# EAGLE design PCB-TLY-BRD4 (EAGLE 7.5.0)
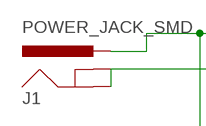
[diagram p0: schematic, sheet 1, part 1 of 2]
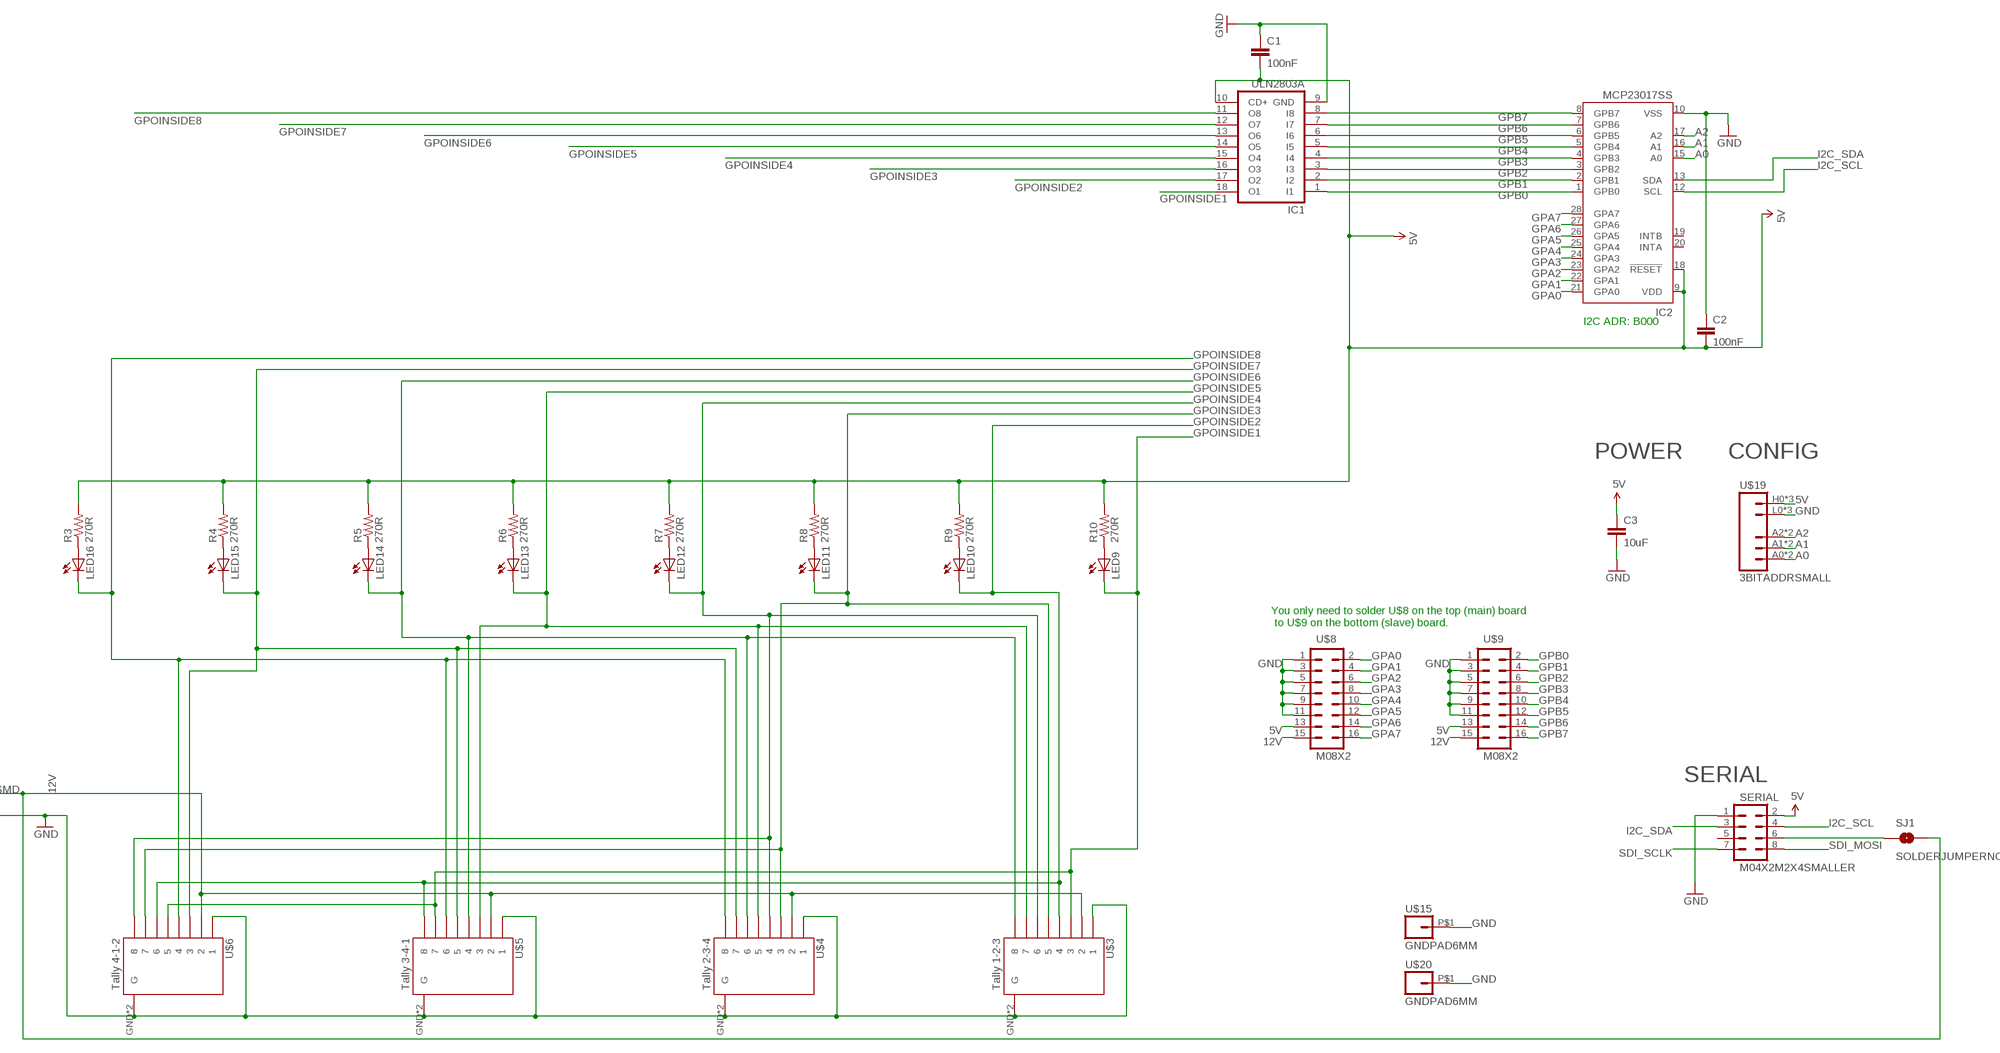
[diagram p1: schematic, sheet 1, part 2 of 2]

## Parts
C1  100nF  CAP0805  [0805]
C2  100nF  CAP0603-CAP  [0603-CAP]
C3  10uF  CAP0805  [0805]
IC1  ULN2803A  ULN2803ASO18W  [SO18W]
IC2  MCP23017SS  [SSOP28]
J1  POWER_JACK_SMD  [POWER_JACK_SMD]
LED9  LED3MM  [LED3MM]
LED10  LED3MM  [LED3MM]
LED11  LED3MM  [LED3MM]
LED12  LED3MM  [LED3MM]
LED13  LED3MM  [LED3MM]
LED14  LED3MM  [LED3MM]
LED15  LED3MM  [LED3MM]
LED16  LED3MM  [LED3MM]
R3  270R  RESISTOR0603-RES  [0603-RES]
R4  270R  RESISTOR0603-RES  [0603-RES]
R5  270R  RESISTOR0603-RES  [0603-RES]
R6  270R  RESISTOR0603-RES  [0603-RES]
R7  270R  RESISTOR0603-RES  [0603-RES]
R8  270R  RESISTOR0603-RES  [0603-RES]
R9  270R  RESISTOR0603-RES  [0603-RES]
R10  270R  RESISTOR0603-RES  [0603-RES]
SERIAL  M04X2M2X4SMALLER  [M2X4SMALLER]
SJ1  SOLDERJUMPERNC2  [SJ_2S-NOTRACE]
U$3  Tally 1-2-3  RJ45-8_GND  [RJ45-8_GND]
U$4  Tally 2-3-4  RJ45-8_GND  [RJ45-8_GND]
U$5  Tally 3-4-1  RJ45-8_GND  [RJ45-8_GND]
U$6  Tally 4-1-2  RJ45-8_GND  [RJ45-8_GND]
U$8  M08X2  [2X8]
U$9  M08X2  [2X8]
U$15  GNDPAD6MM  [3.2MMPAD6MM]
U$19  3BITADDRSMALL  [3BITADDR_SMALL]
U$20  GNDPAD6MM  [3.2MMPAD6MM]

## Nets
5V [Power]: C1.2 C2.2 C3.1 IC1.10(CD+) IC2.9(VDD) IC2.18(!RESET) R3.2 R4.2 R5.2 R6.2 R7.2 R8.2 R9.2 R10.2 SERIAL.2 U$8.13 U$9.13 U$19.H0(VCC) U$19.H1(VCC) U$19.H2(VCC)
12V [Power]: J1.PWR SJ1.2 U$3.2 U$4.2 U$5.2 U$6.2 U$8.15 U$9.15
A0: IC2.15(A0) U$19.A0 U$19.AS0(A0)
A1: IC2.16(A1) U$19.A1 U$19.AS1(A1)
A2: IC2.17(A2) U$19.A2 U$19.AS2(A2)
GND [Power]: C1.1 C2.1 C3.2 IC1.9(GND) IC2.10(VSS) J1.GND SERIAL.1 U$3.1 U$3.GND1(G) U$3.GND(G) U$4.1 U$4.GND1(G) U$4.GND(G) U$5.1 U$5.GND1(G) U$5.GND(G) U$6.1 U$6.GND1(G) U$6.GND(G) U$8.1 U$8.3 U$8.5 U$8.7 U$8.9 U$8.11 U$9.1 U$9.3 U$9.5 U$9.7 U$9.9 U$9.11 U$15.P$1 U$19.L0(GND) U$19.L1(GND) U$19.L2(GND) U$20.P$1
GPA0: IC2.21(GPA0) U$8.2
GPA1: IC2.22(GPA1) U$8.4
GPA2: IC2.23(GPA2) U$8.6
GPA3: IC2.24(GPA3) U$8.8
GPA4: IC2.25(GPA4) U$8.10
GPA5: IC2.26(GPA5) U$8.12
GPA6: IC2.27(GPA6) U$8.14
GPA7: IC2.28(GPA7) U$8.16
GPB0: IC1.1(I1) IC2.1(GPB0) U$9.2
GPB1: IC1.2(I2) IC2.2(GPB1) U$9.4
GPB2: IC1.3(I3) IC2.3(GPB2) U$9.6
GPB3: IC1.4(I4) IC2.4(GPB3) U$9.8
GPB4: IC1.5(I5) IC2.5(GPB4) U$9.10
GPB5: IC1.6(I6) IC2.6(GPB5) U$9.12
GPB6: IC1.7(I7) IC2.7(GPB6) U$9.14
GPB7: IC1.8(I8) IC2.8(GPB7) U$9.16
GPOINSIDE1: IC1.18(O1) LED9.K(C) U$3.3 U$5.7 U$6.5
GPOINSIDE2: IC1.17(O2) LED10.K(C) U$3.4 U$5.8 U$6.6
GPOINSIDE3: IC1.16(O3) LED11.K(C) U$3.5 U$4.3 U$6.7
GPOINSIDE4: IC1.15(O4) LED12.K(C) U$3.6 U$4.4 U$6.8
GPOINSIDE5: IC1.14(O5) LED13.K(C) U$3.7 U$4.5 U$5.3
GPOINSIDE6: IC1.13(O6) LED14.K(C) U$3.8 U$4.6 U$5.4
GPOINSIDE7: IC1.12(O7) LED15.K(C) U$4.7 U$5.5 U$6.3
GPOINSIDE8: IC1.11(O8) LED16.K(C) U$4.8 U$5.6 U$6.4
I2C_SCL: IC2.12(SCL) SERIAL.4
I2C_SDA: IC2.13(SDA) SERIAL.3
N$1 [Power]: SERIAL.6 SJ1.1
N$2: LED16.A R3.1
N$3: LED15.A R4.1
N$4: LED14.A R5.1
N$7: LED13.A R6.1
N$8: LED12.A R7.1
N$9: LED11.A R8.1
N$11: LED10.A R9.1
N$12: LED9.A R10.1
SDI_MOSI: SERIAL.8
SDI_SCLK: SERIAL.7
Unconnected: IC2.19(INTB) IC2.20(INTA) J1.SHUNT(GNDBREAK) SERIAL.5

## Notes on the sheet
- I2C ADR: B000
- POWER | CONFIG
- You only need to solder U$8 on the top (main) board
   to U$9 on the bottom (slave) board.
- SERIAL

## Library data of the parts
C1-C3 = SparkFun:CAP: Capacitor Standard 0603 ceramic capacitor, and 0.1" leaded capacitor.
IC1 = uln-udn:ULN2803A: DRIVER ARRAY
IC2 = microchip:MCP23017: http://ww1.microchip.com/downloads/en/DeviceDoc/21952a.pdf Source: http://ww1.microchip.com/downloads/en/DeviceDoc/21952a.pdf; MF: MICROCHIP; MPN: MCP23017-E/SS; OC_FARNELL: 1467674; OC_NEWARK: 31K2960
J1 = SKAARHOJ:POWER_JACK_SMD: RASM712PX Right Angle SMT Mount DC Power Jack, pin size 0.100"(2.5mm), with locating post Switchcraft.com
LED9-LED16 = led:LED: LED OSRAM: - CHIPLED LG R971, LG N971, LY N971, LG Q971, LY Q971, LO R971, LY R971 LH N974, LH R974 LS Q976, LO Q976, LY Q976 LO Q996 - Hyper CHIPLED LW Q18S LB Q993, LB Q99A, LB R99A - SideLED LS A670, LO A670, LY A670, LG A670, LP A670 LB A673, LV A673, LT A673, LW A673 LH A674 LY A675 LS A676, LA A676, LO A676, LY A676, LW A676 LS A679, LY A679, LG A679 - Hyper Micro SIDELED® LS Y876, LA Y876, LO Y876, LY Y876 LT Y87S - SmartLED LW L88C, LW L88S LB L89C, LB L89S, LG L890 LS L89K, LO L89K, LY L89K LS L896, LA L896, LO L896, LY L896 - TOPLED LS T670, LO T670, LY T670, LG T670, LP T670 LSG T670, LSP T670, LSY T670, LOP T670, LYG T670 LG T671, LOG T671, LSG T671 LB T673, LV T673, LT T673, LW T673 LH T674 LS T676, LA T676, LO T676, LY T676, LB T676, LH T676, LSB T676, LW T676 LB T67C, LV T67C, LT T67C, LS T67K, LO T67K, LY T67K, LW E67C LS E67B, LA E67B, LO E67B, LY E67B, LB E67C, LV E67C, LT E67C LW T67C LS T679, LY T679, LG T679 LS T770, LO T770, LY T770, LG T770, LP T770 LB T773, LV T773, LT T773, LW T773 LH T774 LS E675, LA E675, LY E675, LS T675 LS T776, LA T776, LO T776, LY T776, LB T776 LHGB T686 LT T68C, LB T68C - Hyper Mini TOPLED® LB M676 - Mini TOPLED Santana® LG M470 LS M47K, LO M47K, LY M47K Source: http://www.osram.convergy.de LUXEON: - LUMILED® LXK2-PW12-R00, LXK2-PW12-S00, LXK2-PW14-U00, LXK2-PW14-V00 LXK2-PM12-R00, LXK2-PM12-S00, LXK2-PM14-U00 LXK2-PE12-Q00, LXK2-PE12-R00, LXK2-PE12-S00, LXK2-PE14-T00, LXK2-PE14-U00 LXK2-PB12-K00, LXK2-PB12-L00, LXK2-PB12-M00, LXK2-PB14-N00, LXK2-PB14-P00, LXK2-PB14-Q00 LXK2-PR12-L00, LXK2-PR12-M00, LXK2-PR14-Q00, LXK2-PR14-R00 LXK2-PD12-Q00, LXK2-PD12-R00, LXK2-PD12-S00 LXK2-PH12-R00, LXK2-PH12-S00 LXK2-PL12-P00, LXK2-PL12-Q00, LXK2-PL12-R00 Source: www.luxeon.com KINGBRIGHT: KA-3528ASYC Source: www.kingbright.com
R3-R10 = SparkFun:RESISTOR: Resistor Basic schematic elements and footprints for 0603, 1206, and PTH resistors.
SERIAL = SKAARHOJ:M04X2
SJ1 = SparkFun:SOLDERJUMPER: Solder Jumper Standard SMD solder jumper. Used to automate production. Two varients : Normally Open and Normally Closed are the same, but have different paste layers. NC will have a large amount of paste and should jumper during reflow.
U$3-U$6 = SKAARHOJ:RJ45-8_GND
U$8 U$9 = SparkFun:M08X2
U$15 U$20 = SKAARHOJ:GNDPAD
U$19 = SKAARHOJ:3BITADDR

## Net classes
0 default: width 0.203 mm, drill 0.406 mm, clearance 0.203 mm
1 Power: width 0.406 mm, drill 0.61 mm, clearance 0.203 mm
2 RELAY LINES: width 0.305 mm, clearance 0.254 mm
3 INput lines: clearance 0.254 mm

## Board
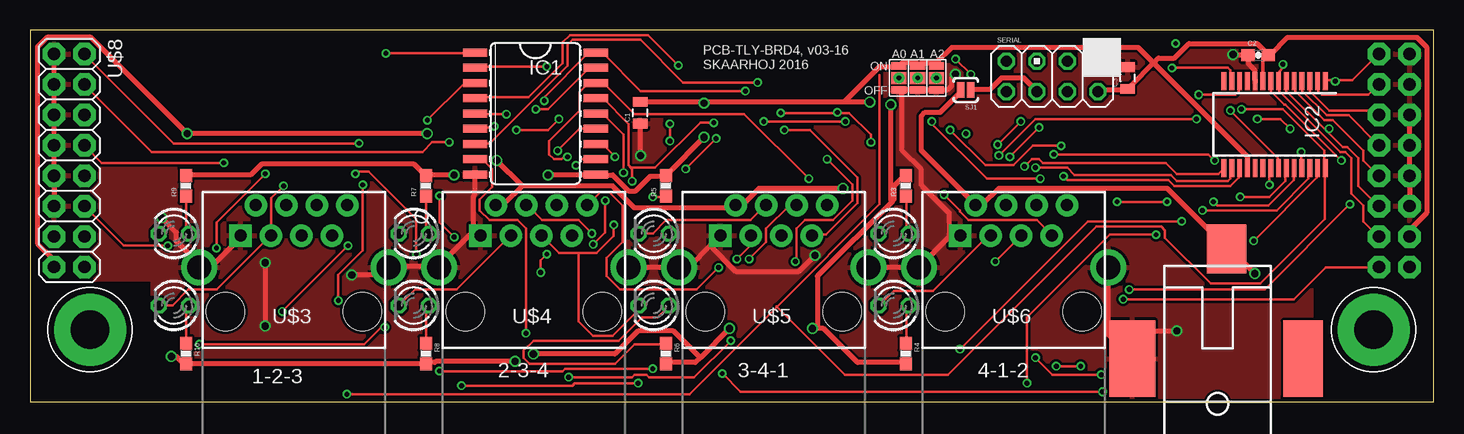
[diagram p2: board, top side]
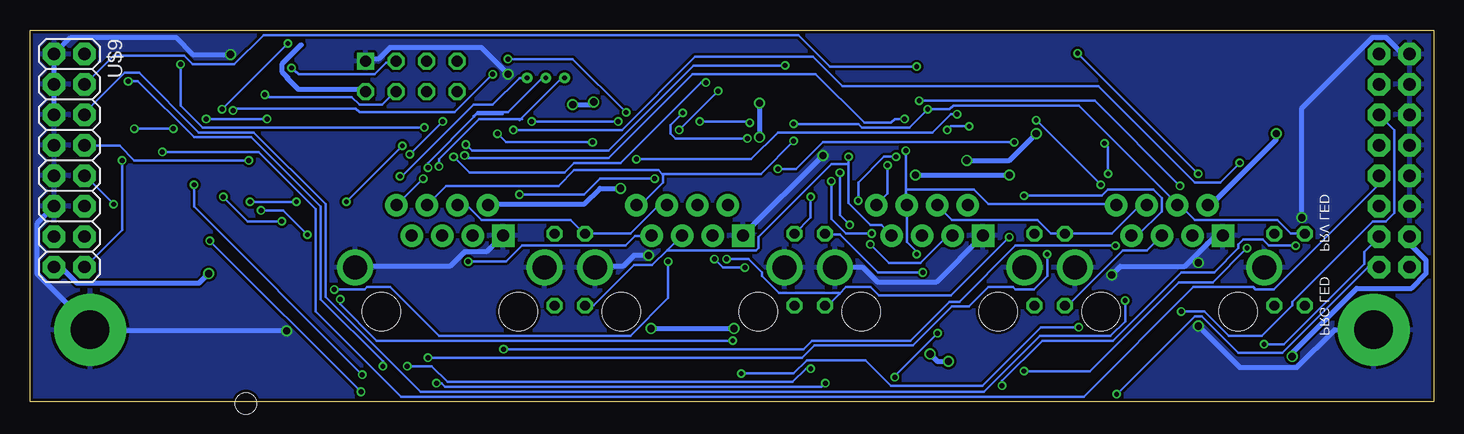
[diagram p3: board, bottom side, seen from below]

Size 117 x 31 mm. Coordinates in mm from the lower left corner, seen from the top.
Outline: 117,0 117,31 0,31 0,0 117,0
Copper layers (1*16): Top 0.035mm / dielectric 1.5mm / Bottom 0.035mm
Design rules "Fusion_eagle_rule_v1.1": minimum track width 6mil, minimum drill 12mil, track to track 6mil, track to pad 6mil, pad to pad 6mil, via to via 6mil, smd to smd 0mil, copper to edge 10mil, drill to drill 10mil, minimum pad ring 10mil, minimum via ring 6mil, stop-mask expansion 2mil, vias tented up to drill 100mil, thermal gap 10mil
bKeepout: area 0,0 to 10,10; area 140,0 to 150,10
tRestrict: area 0,0 to 10,10; area 107,0 to 117,10

### Footprints (pad centres in the part's own frame; a part is rotated, then mirrored left to right if it is on the bottom)
0805 = smd 0.8 x 1.2: 1 -0.9,0; 2 0.9,0
0603-CAP = smd 1.1 x 1: 1 -0.85,0; 2 0.85,0
SO18W = smd 0.66 x 2.032: 1 -5.08,-5.029; 2 -3.81,-5.029; 3 -2.54,-5.029; 4 -1.27,-5.029; 5 0,-5.029; 6 1.27,-5.029; 7 2.54,-5.029; 8 3.81,-5.029; 9 5.08,-5.029; 10 5.08,5.029; 11 3.81,5.029; 12 2.54,5.029; 13 1.27,5.029; 14 0,5.029; 15 -1.27,5.029; 16 -2.54,5.029; 17 -3.81,5.029; 18 -5.08,5.029
SSOP28 = smd 0.4 x 1.5: 1 -4.225,-3.625; 2 -3.575,-3.625; 3 -2.925,-3.625; 4 -2.275,-3.625; 5 -1.625,-3.625; 6 -0.975,-3.625; 7 -0.325,-3.625; 8 0.325,-3.625; 9 0.975,-3.625; 10 1.625,-3.625; 11 2.275,-3.625; 12 2.925,-3.625; 13 3.575,-3.625; 14 4.225,-3.625; 15 4.225,3.625; 16 3.575,3.625; 17 2.925,3.625; 18 2.275,3.625; 19 1.625,3.625; 20 0.975,3.625; 21 0.325,3.625; 22 -0.325,3.625; 23 -0.975,3.625; 24 -1.625,3.625; 25 -2.275,3.625; 26 -2.925,3.625; 27 -3.575,3.625; 28 -4.225,3.625
POWER_JACK_SMD = smd 6.35 x 3.81: GND -6.756,-7.112 | smd 4.064 x 3.302: PWR -15.9,0.762 | smd 6.35 x 3.302: SHUNT -6.756,7.112 | hole 1.778: -2.997,0
LED3MM = drill 0.813 octagon: A -1.27,0; K 1.27,0
0603-RES = smd 1.1 x 1: 1 -0.85,0; 2 0.85,0
M2X4SMALLER = drill 0.9 square: 1 -1.27,3.81 | drill 0.9 octagon: 2 1.27,3.81; 3 -1.27,1.27; 4 1.27,1.27; 5 -1.27,-1.27; 6 1.27,-1.27; 7 -1.27,-3.81; 8 1.27,-3.81
SJ_2S-NOTRACE = smd 0.635 x 1.27: 1 -0.401,0; 2 0.413,0
RJ45-8_GND = drill 1 pad 1.88 square: 1 -4.445,6.35 | drill 1 pad 1.88: 2 -3.175,8.89; 3 -1.905,6.35; 4 -0.635,8.89; 5 0.635,6.35; 6 1.905,8.89; 7 3.175,6.35; 8 4.445,8.89 | drill 2: GND -7.9,3.7; GND1 7.9,3.7 | hole 3.2: -5.715,0; 5.715,0
2X8 = drill 1.016 pad 1.88 octagon: 1 0,0; 2 0,2.54; 3 2.54,0; 4 2.54,2.54; 5 5.08,0; 6 5.08,2.54; 7 7.62,0; 8 7.62,2.54; 9 10.16,0; 10 10.16,2.54; 11 12.7,0; 12 12.7,2.54; 13 15.24,0; 14 15.24,2.54; 15 17.78,0; 16 17.78,2.54
3.2MMPAD6MM = drill 3.2 pad 6: P$1 0,0
3BITADDR_SMALL = drill 0.4: A0 -1.565,0; A1 0,0; A2 1.565,0 | smd 1.27 x 1: AS0 -1.565,0; AS1 0,0; AS2 1.565,0 | smd 1.27 x 0.635: H0 -1.565,1; H1 0,1; H2 1.565,1; L0 -1.565,-1; L1 0,-1; L2 1.565,-1

### Placement (x,y rotation side)
C1  50.87,24.09 90 top
C2  102.39,28.9 0 top
C3  91.5,27 90 top
IC1  42.13,24.03 270 top
IC2  103.75,23.11 180 top
J1  99,-3.17 270 top
LED9  12,8 180 top
LED10  12,14 180 top
LED11  32,8 180 top
LED12  32,14 180 top
LED13  52,8 180 top
LED14  52,14 180 top
LED15  72,8 180 top
LED16  72,14 180 top
R3  73,18 90 top
R4  73,4 270 top
R5  53,18 90 top
R6  53,4 270 top
R7  33,18 90 top
R8  33,4 270 top
R9  13,18 90 top
R10  13,4 270 top
SERIAL  85.21,27.12 270 top
SJ1  78,26 180 top
U$3  22,7.5 0 top
U$4  42,7.5 0 top
U$5  62,7.5 0 top
U$6  82,7.5 0 top
U$8  2,29 270 top
U$9  115,29 270 bottom
U$15  5,6 0 top
U$19  74,27 0 top
U$20  112,6 0 top

### Tracks (layer width: path | path; a pad name or v marks a point on that pad's centre or on a via)
5V  (via drill 0.61)
  Top 0.305: C2.2 102.78,28.9 IC2.9
  Top 0.406: 93.67,28.25 94.08,28.65 95.4,28.65 96.62,29.87 102.31,29.87 103.23,28.96 C2.2 103.43,28.96 104.85,30.38 115.62,30.38 116.43,29.57 116.43,15.75 115.01,14.33 115.01,13.82 U$9.13 | 93.67,28.25 101.5,20.42 101.5,19.51 IC2.18 | v11.79,3.76 12.19,3.76 12.8,3.15 R10.2 32.92,3.15 R8.2 33.12,3.25 33.73,3.25 33.83,3.35 v40.44,3.35 | v58.32,6.1 55.88,3.66 | 55.88,3.66 55.47,3.25 53.03,3.25 R6.2 | R4.2 72.95,3.25 68.99,3.25 66.14,6.1 v65.23,6.1 65.63,6.2 65.63,10.46 71.88,16.71 | R9.2 13.01,18.9 18.39,18.9 19.3,19.81 32,19.81 32.92,18.9 R7.2 33.12,18.9 v35.36,18.9 | 72.95,18.9 R3.2 72.85,18.8 72.03,17.98 72.03,16.87 71.88,16.71 | v70,24.99 67.94,24.99 | 67.94,24.99 56.19,24.99 | 56.19,24.99 50.9,24.99 C1.2 | v56.19,22.05 53.14,19 R5.2 52.93,18.8 51.71,18.8 50.49,17.58 49.89,17.58 48.56,18.9 47.24,18.9 IC1.10 47.04,18.9 v43.18,18.9 | v56.19,24.89 56.19,24.99 | v41.96,3.96 48.77,3.96 50.7,5.89 53.65,5.89 55.88,3.66 | SERIAL.2 89.22,26.04 91.44,26.04 C3.1 91.76,26.35 93.66,28.26 | 75.56,28.26 74.3,28.26 U$19.H1 73.98,28.26 72.71,28.26 U$19.H0 72.39,27.94 70.8,27.94 67.94,25.08 67.94,24.99 | 75.56,28.26 76.83,29.53 92.39,29.53 93.66,28.26 | 75.56,28.26 U$19.H2 | 93.66,28.26 93.67,28.25 | v71.75,24.77 71.75,16.83 71.88,16.71
  Bottom 0.406: v11.79,3.76 11.79,4.06 6.4,9.45 1.83,9.45 0.61,10.67 0.61,11.79 1.93,13.11 1.93,13.72 U$8.13 | v65.23,6.1 v58.32,6.1 | v56.19,24.89 v56.19,22.05 | v43.18,18.9 v35.36,18.9 | v40.44,3.35 41.35,3.35 v41.96,3.96 | 95.52,27.04 96.01,27.53 96.01,28.14 94.39,29.77 | 95.52,27.04 95.5,27.03 | 95.52,27.04 95.57,26.99 94.61,26.04 89.22,26.04 SERIAL.2 | v71.75,24.77 70.17,24.77 v70,24.99
12V  (via drill 0.61)
  Top 0.406: U$8.15 1.93,11.28 1.93,11.89 0.61,13.21 0.61,29.57 1.42,30.38 5.08,30.38 v13.11,22.35 v33.12,22.35 | 41.05,17.98 39.52,16.46 38.91,16.46 U$4.2 | 41.05,17.98 48.56,17.98 50.39,16.15 58.52,16.15 58.73,16.36 U$5.2 59.03,16.36 59.33,16.36 60.76,17.78 v67.77,17.78 | v102.11,10.67 99.97,12.8 J1.PWR 99.77,12.8 94.79,17.78 80.77,17.78 79.45,16.46 78.84,16.46 U$6.2 78.74,16.51 74.3,20.95 74.3,23.81 74.61,24.13 75.88,24.13 77.47,25.72 SJ1.2 | 41.05,17.98 v38.91,20.12
  Bottom 0.406: v13.11,22.35 13.11,21.84 18.49,16.46 18.8,16.46 U$3.2 | v102.11,10.67 102.92,9.86 113.08,9.86 114.4,11.18 114.91,11.18 U$9.15 | v67.77,17.78 69.49,17.78 70.81,16.46 78.74,16.46 U$6.2 | v33.12,22.35 35.36,20.12 v38.91,20.12
A0  (via drill 0.41)
  Top 0.203: v82.91,19.61 83.52,20.22 84.12,20.22 84.43,19.91 94.69,19.91 95.61,19 99.06,19 99.47,19.41 IC2.15 | 72.71,26.99 U$19.AS0
  Bottom 0.203: v82.91,19.61 82.91,20.22 79.55,23.57 76.2,23.57 | 76,23.57 76.2,23.57 | U$19.AS0 72.71,26.99 76.2,23.5 76.2,23.57
A1  (via drill 0.41)
  Top 0.203: v83.82,19.51 86.46,19.51 87.07,18.9 95.1,18.9 95.61,18.39 99.87,18.39 100.08,18.59 100.08,19.41 IC2.16 | 74.3,26.99 U$19.AS1
  Bottom 0.203: v83.82,19.51 83.82,19.91 79.97,23.77 | 79.97,23.77 79.76,23.98 77.62,23.98 | U$19.AS1 74.3,26.99 77.15,24.13 79.69,24.13 80.01,23.81 79.97,23.77
A2  (via drill 0.41)
  Top 0.203: v86.16,18.8 86.46,18.49 94.89,18.49 95.4,17.98 100.08,17.98 100.79,18.69 100.79,19.41 IC2.17 | 75.56,26.99 U$19.AS2
  Bottom 0.203: U$19.AS2 75.56,26.99 76.2,26.99 78.42,24.77 80.01,24.77 86.04,18.73 v86.16,18.8
GND  (via drill 0.61)
  Top 0.406: U$9.11 115.01,16.36 115.01,18.8 U$9.9 115.01,19 115.01,21.34 U$9.7 115.01,21.54 115.01,23.88 U$9.5 | IC2.10 102.11,26.82 102.11,27.64 101.6,28.14 101.6,28.85 C2.1 101.4,28.96 v100.28,28.96 | U$6.GND1 89.92,11.18 89.92,5.59 91.85,3.66 J1.GND 90.02,5.89 v95.61,5.89 | 76.71,13.82 77.52,13.82 U$6.1 | 76.71,13.82 74.17,11.28 U$6.GND 73.97,11.18 69.9,11.18 U$5.GND1 | 76.71,13.82 76.61,13.92 76.61,15.75 74.37,17.98 74.3,18.1 74.3,19.37 72.71,20.95 72.71,25.72 U$19.L0 72.71,26.04 73.98,26.04 U$19.L1 74.3,26.04 75.56,26.04 | U$4.GND1 49.99,11.18 54.05,11.18 U$5.GND 54.25,11.28 54.97,11.28 56.69,13.01 | v50.9,20.52 50.9,23.16 C1.1 | 56.69,13.01 57.51,13.82 U$5.1 | U$8.11 2.03,16.36 2.03,18.8 U$8.9 2.03,19 2.03,21.34 U$8.7 2.03,21.54 2.03,23.88 U$8.5 2.03,24.08 2.03,26.42 U$8.3 2.03,26.62 2.03,28.96 U$8.1 | U$3.1 17.48,13.82 17.48,13.61 15.14,11.28 14.12,11.28 U$3.GND 14.12,11.48 12.19,13.41 12.19,14.12 v10.97,15.34 | IC1.9 37.08,18.9 37.08,17.27 36.98,17.17 36.98,14.43 37.49,13.92 U$4.1 36.98,14.22 34.04,11.28 U$4.GND 33.83,11.28 29.97,11.28 U$3.GND1 29.77,11.07 29.26,10.57 v26.82,10.57 | v19.61,11.58 v19.61,6.3 | v65.43,12.19 64.11,10.87 58.83,10.87 56.69,13.01 | C3.2 91.44,27.94 89.53,27.94 89.22,28.26 SERIAL.1 | v77.15,27.3 76.83,26.99 76.83,26.35 76.52,26.04 75.56,26.04 | 75.56,26.04 U$19.L2
  Bottom 0.406: v100.28,28.96 103.43,28.96 104.85,30.38 113.59,30.38 114.91,29.06 U$9.1 115.01,28.85 115.01,26.52 U$9.3 115.01,26.31 115.01,23.98 U$9.5 | U$9.11 115.01,16.26 116.43,14.83 116.43,10.67 112.06,6.3 112.06,6.1 U$20.P$1 111.86,5.89 v95.61,5.89 | U$6.GND1 89.81,11.28 81.99,11.28 80.77,12.5 78.94,12.5 77.62,13.82 U$6.1 | v50.9,20.52 57.51,13.92 U$5.1 | 20.02,11.99 20.73,11.28 26.11,11.28 v26.82,10.57 | 20.02,11.99 18.19,13.82 17.58,13.82 U$3.1 | v10.97,15.34 10.97,24.49 5.08,30.38 3.96,30.38 2.64,29.06 2.03,29.06 U$8.1 | U$4.GND1 49.89,11.18 47.55,11.18 46.33,9.96 41.45,9.96 37.59,13.82 U$4.1 | v19.61,6.3 16.15,2.85 11.38,2.85 8.23,5.99 5.08,5.99 U$15.P$1 | 20.02,11.99 v19.61,11.58 | v65.43,12.19 66.65,12.19 67.56,11.28 69.8,11.28 U$5.GND1 | v77.15,27.3 79.38,29.53 87,29.53 87.95,28.57 88.9,28.57 SERIAL.1
  pour Top: 0,0 117,0 117,31 0,31
  pour Bottom: 0,0 117,0 117,31 0,31
GPA0  (via drill 0.41)
  Top 0.203: v103.33,18.09 103.33,19.41 IC2.21 | v89.31,2.23 85.24,2.23 v83.82,3.66 | v32.21,12.29 32.21,15.24 28.25,19.2 27.33,19.2 v27.13,19 | v27.43,21.54 11.99,21.54 4.57,28.96 U$8.2
  Bottom 0.203: v103.33,18.09 103.33,16.26 v89.31,2.23 | v83.82,3.66 52.63,3.66 51.61,4.67 43.38,4.67 40.13,7.92 38.71,7.92 37.08,9.55 35.05,9.55 34.85,9.35 33.33,9.35 32.21,10.46 v32.21,12.29 | v27.13,19 27.13,21.23 v27.43,21.54
GPA1  (via drill 0.41)
  Top 0.203: v100.08,24.28 104.04,20.32 104.04,19.51 IC2.22 | v70.1,21.64 70.1,22.25 68.28,24.08 67.31,24.08 | v62.59,24.08 67.31,24.08 | v54.66,19.41 v57.2,21.95 | v34.95,21.64 33.53,21.64 32.72,20.83 10.16,20.83 4.57,26.42 U$8.4 | v77.15,28.57 v78.42,27.3 | v67.31,24.13 67.31,24.08
  Bottom 0.203: v78.03,22.35 77.32,21.64 v70.1,21.64 | v62.59,24.08 63.6,23.06 63.6,22.35 63.2,21.95 v57.2,21.95 | v54.66,19.41 53.14,19.41 50.9,21.64 v34.95,21.64 | v78.42,27.3 81.6,24.13 89.53,24.13 89.85,24.45 100.01,24.45 v100.08,24.28 | v77.15,28.57 71.75,28.57 v67.31,24.13
GPA2  (via drill 0.41)
  Top 0.203: v100.89,17.07 103.33,17.07 104.65,18.39 104.65,19.41 IC2.23 | v96.01,15.04 88.19,15.04 v77.52,4.37 | v21.03,7.52 v26.52,13.01
  Bottom 0.203: v100.89,17.07 98.86,15.04 v96.01,15.04 | v77.52,4.37 52.53,4.37 51.82,5.08 43.59,5.08 40.34,8.33 39.52,8.33 34.85,13.01 v26.52,13.01 | v21.03,7.52 19.1,7.52 17.07,5.49 14.33,5.49 11.79,8.03 11.79,8.33 5.08,15.04 3.96,15.04 3.25,15.75 3.25,22.66 4.47,23.88 U$8.6
GPA3  (via drill 0.41)
  Top 0.203: v98.65,16.66 98.96,16.36 103.23,16.36 105.36,18.49 105.36,19.41 IC2.24 | v90.63,16.66 v94.79,16.66 | v85.95,21.34 83.62,21.34 81.99,19.71 79.65,19.71 v76.71,22.66 | v16.15,19.91 5.99,19.91 4.57,21.34 U$8.8
  Bottom 0.203: v94.79,16.66 v98.65,16.66 | v85.95,21.34 v90.63,16.66 | v76.71,22.66 67.67,22.66 61.57,28.75 51.71,28.75 49.28,26.31 27.94,26.31 19.91,18.29 17.78,18.29 v16.15,19.91
GPA4  (via drill 0.41)
  Top 0.203: v105.97,20.83 105.97,19.51 IC2.25
  Bottom 0.203: v105.97,20.83 97.94,20.83 93.17,16.05 93.17,7.52 86.06,0.41 29.16,0.41 20.02,9.55 15.04,9.55 14.83,9.35 13.31,9.35 4.57,18.09 4.57,18.8 U$8.10
GPA5  (via drill 0.41)
  Top 0.203: v97.74,15.95 103.94,15.95 106.58,18.59 106.58,19.41 IC2.26 | v93.88,13.92 90.02,13.92 83.11,7.01 v83.11,1.52 | v50.7,1.52 45.41,1.52 45.21,1.32 v35.97,1.32 | v11.48,13.01 7.82,13.01 4.57,16.26 U$8.12
  Bottom 0.203: v97.74,15.95 95.91,15.95 v93.88,13.92 | v83.11,1.52 82.7,1.52 82.4,1.22 51,1.22 v50.7,1.52 | v35.97,1.32 35.97,1.73 32.61,5.08 26.72,5.08 21.03,10.77 18.29,10.77 16.26,12.8 16.26,13.11 15.85,13.51 14.22,13.51 13.72,13.01 v11.48,13.01
GPA6  (via drill 0.41)
  Top 0.203: v102.01,13.41 107.29,18.69 107.29,19.41 IC2.27 | v89.41,0.81 59.23,0.81 v57.71,2.34 | v29.57,6.2 29.26,6.2 27.84,4.78 v14.12,4.78
  Bottom 0.203: v89.41,0.81 v102.01,13.41 | v57.71,2.34 53.34,2.34 52.22,3.45 47.35,3.45 45.21,1.32 37.59,1.32 32.72,6.2 v29.57,6.2 | v14.12,4.78 12.5,4.78 5.79,11.48 5.79,12.5 4.57,13.72 U$8.14
GPA7  (via drill 0.41)
  Top 0.203: v100.99,24.38 104.44,24.38 107.9,20.93 107.9,19.51 IC2.28 107.95,19.37 107.95,15.24 102.55,9.84 98.42,9.84 94.61,13.65 94.61,14.29 94.3,14.61 88.9,14.61 76.52,2.22 67.94,2.22 62.26,7.91 | 70.81,27.23 70.81,16.46 62.26,7.91 | 62.26,7.91 54.97,0.61 v26.42,0.61 | 62.23,7.94 62.26,7.91
  Bottom 0.203: v95.5,29.87 v100.99,24.38 | v26.42,0.61 19.91,7.11 19.3,7.11 16.26,4.06 12.6,4.06 5.49,11.18 4.57,11.18 U$8.16
GPB0  (via drill 0.41)
  Top 0.203: 108.81,26.82 110.24,26.82 112.37,28.96 U$9.2 | 108.81,26.82 108,26.82 IC2.1 | v29.67,29.06 37.08,29.06 IC1.1 | v19.61,19 15.54,14.94 v15.54,12.8 | v34.14,2.54 44.4,2.54 44.6,2.74 v51.92,2.74 | v87.58,2.95 v85.55,2.95 | 108.81,26.82 v108.81,26.72
  Bottom 0.203: v19.61,19 v29.67,29.06 | v15.54,12.8 18.39,9.96 21.23,9.96 28.65,2.54 v34.14,2.54 | v51.92,2.74 52.32,2.74 53.44,1.63 82.19,1.63 83.52,2.95 v85.55,2.95 | v87.58,2.95 87.58,3.35 92.76,8.53 92.76,16.26 98.55,22.05 103.33,22.05 108,26.72 v108.81,26.72
GPB1  (via drill 0.41)
  Top 0.203: IC2.2 107.39,26.72 107.39,25.91 107.7,25.6 111.56,25.6 112.37,26.42 U$9.4 | v43.08,27.94 37.19,27.94 IC1.2
  Bottom 0.203: v43.08,27.94 50.29,27.94 52.93,30.58 97.54,30.58 99.97,28.14 103.43,28.14 104.14,28.85 110.03,28.85 112.37,26.52 U$9.4
GPB2  (via drill 0.41)
  Top 0.203: IC2.3 106.68,25.91 108.31,24.28 112.06,24.28 112.37,23.98 U$9.6 | v33.12,23.47 36.17,26.52 37.08,26.52 IC1.3 | v27.74,18.09 27.74,12.6 25.7,10.57 v25.7,8.43
  Bottom 0.203: v27.74,18.09 v33.12,23.47 | v25.7,8.43 25.7,6.71 26.92,5.49 32.82,5.49 37.49,0.81 84.43,0.81 92.35,8.74 92.35,16.46 98.35,22.45 102.92,22.45 107.9,27.43 109.12,27.43 112.37,24.18 112.37,23.98 U$9.6
GPB3  (via drill 0.41)
  Top 0.203: IC2.4 106.07,26.72 106.07,25.91 108.1,23.88 109.93,23.88 112.37,21.44 U$9.8 | v54.05,28.04 51.51,30.58 45.01,30.58 44.4,29.97 44.4,28.25 41.55,25.4 37.19,25.4 IC1.4 | v82.6,23.37 v80.67,21.44 | v85.34,20.62 98.25,20.62 v98.75,20.12
  Bottom 0.203: v54.05,28.04 61.67,28.04 68.78,20.93 80.16,20.93 v80.67,21.44 | v85.34,20.62 v82.6,23.37 | v98.75,20.12 108.31,20.12 109.53,21.34 112.37,21.34 U$9.8
GPB4  (via drill 0.41)
  Top 0.203: IC2.5 105.46,26.72 105.46,25.91 107.9,23.47 108.61,23.47 111.15,20.93 111.15,20.12 112.37,18.9 U$9.10 | v39.73,23.98 37.19,23.98 IC1.5 | v66.45,20.22 68.58,18.09 68.58,16.76 66.95,15.14 64.62,15.14 63.91,14.43 63.91,11.79 v63.8,11.68 | v91.64,9.35 102.92,9.35 v110.03,16.46
  Bottom 0.203: v39.73,23.98 40.23,23.98 41.76,22.45 54.66,22.45 56.9,20.22 v66.45,20.22 | v63.8,11.68 63.8,8.64 66.95,5.49 82.91,5.49 86.97,9.55 88.9,9.55 89.1,9.35 v91.64,9.35 | v110.03,16.46 112.37,18.8 U$9.10
GPB5  (via drill 0.41)
  Top 0.203: 108.1,22.55 109.42,21.23 109.83,21.23 110.74,20.32 110.74,17.98 112.37,16.36 U$9.12 | 108.1,22.55 104.75,25.91 104.75,26.72 IC2.6 | v38.71,22.96 38.61,22.86 37.19,22.86 IC1.6 | v40.54,22.66 43.18,22.66 v44.09,23.57 | v80.77,20.52 83.82,23.57 v97.23,23.57 | v102.31,23.57 104.24,23.57 v105.05,22.76 | 108.1,22.55 v108.31,22.76
  Bottom 0.203: v38.71,22.96 40.23,22.96 v40.54,22.66 | v44.09,23.57 44.91,23.57 45.21,23.27 47.45,23.27 51.51,27.33 61.77,27.33 68.78,20.32 80.57,20.32 v80.77,20.52 | v102.31,23.57 v97.23,23.57 | v108.31,22.76 v105.05,22.76
GPB6  (via drill 0.41)
  Top 0.203: U$9.14 112.37,13.82 111.15,15.04 111.15,16.36 110.13,17.37 110.13,20.32 109.63,20.83 109.22,20.83 104.14,25.91 104.14,26.72 IC2.7 104.14,26.82 104.14,27.53 104.44,27.84 v104.44,28.14 | v60.66,26.62 54.46,26.62 50.9,30.18 45.21,30.18 44.81,29.77 44.81,28.04 38.3,21.54 37.19,21.54 IC1.7 | v84.12,22.86 v81.69,20.42
  Bottom 0.203: v60.66,26.62 61.06,26.62 67.77,19.91 71.63,19.91 72.44,19.1 80.37,19.1 v81.69,20.42 | v84.12,22.86 102.62,22.86 104.44,24.69 v104.44,28.14
GPB7  (via drill 0.41)
  Top 0.203: v109.32,20.12 104.65,24.79 104.55,24.79 103.43,25.91 IC2.8 | v41.35,5.69 41.35,14.43 40.64,15.14 38.3,15.14 37.49,15.95 37.49,16.87 38.51,17.88 38.51,19.41 37.69,20.22 37.19,20.22 IC1.8 | v44.91,2.03 50.19,2.03 50.39,2.23 51.41,2.23 51.61,2.03 55.37,2.03 v58.42,5.08 | v91.14,8.53 105.36,8.53 108,11.18 112.37,11.18 U$9.16
  Bottom 0.203: v109.32,20.12 109.32,14.33 112.37,11.28 U$9.16 | v41.35,5.69 44.91,2.13 v44.91,2.03 | v58.42,5.08 88.09,5.08 91.14,8.13 v91.14,8.53
GPOINSIDE1  (via drill 0.41)
  Top 0.203: v80.47,11.68 82.6,13.82 U$6.5 | v42.88,25.09 42.88,25.4 46.53,29.06 47.14,29.06 IC1.18 47.24,29.06 47.75,29.06 50.9,25.91 v59.64,25.91 | v21.13,17.98 20.12,16.97 20.12,13.92 U$3.3 20.02,13.82 15.54,9.35 13.21,9.35 11.89,8.03 10.77,8.03 LED9.K | v62.89,22.66 65.02,22.66 68.99,18.69 68.99,16.56 66.34,13.92 65.23,13.92 U$5.7
  Bottom 0.203: v80.47,11.68 77.32,11.68 76,13.01 67.36,13.01 66.55,13.82 65.23,13.82 U$5.7 | v42.88,25.09 28.25,25.09 v21.13,17.98 | v59.64,25.91 v62.89,22.66
GPOINSIDE2  (via drill 0.41)
  Top 0.203: v42.16,24.38 43.18,24.38 46.63,27.84 47.14,27.84 IC1.17 | v53.34,23.16 v53.34,21.74
  Bottom 0.203: 64.26,18.95 64.62,19.3 71.63,19.3 72.95,17.98 82.3,17.98 83.82,16.46 U$6.6 | 64.26,18.95 64.21,18.9 64.21,18.29 66.04,16.46 66.34,16.46 U$5.8 | LED10.K 10.77,14.02 11.89,14.02 13.01,15.14 19.91,15.14 21.23,16.46 U$3.4 21.34,16.46 29.57,24.69 40.03,24.69 40.34,24.38 v42.16,24.38 43.69,22.86 47.65,22.86 47.95,23.16 v53.34,23.16 | v53.34,21.74 56.08,19 64.21,19 64.26,18.95
GPOINSIDE3  (via drill 0.41)
  Top 0.203: U$4.3 40.03,13.82 35.56,9.35 32.11,9.35 30.79,8.03 LED11.K | v64.92,18.59 59.54,23.98 50.39,23.98 47.85,26.52 47.24,26.52 IC1.16 47.14,26.52 46.53,26.52 45.82,25.81 45.82,24.28 43.28,21.74 43.28,20.62 43.69,20.22 44.3,20.22 44.5,20.42 v44.81,20.42 | v76.2,17.27 77.52,15.95 77.52,15.85 78.23,15.14 83.92,15.14 85.14,13.92 U$6.7 | v46.94,13.11 47.95,14.12 v47.95,16.76
  Bottom 0.203: LED11.K 30.68,8.03 30.48,8.03 25.91,12.6 23.88,12.6 22.66,13.82 U$3.5 | v64.92,18.59 69.49,18.59 70.81,17.27 v76.2,17.27 | v46.94,13.11 45.41,11.58 42.77,11.58 40.54,13.82 40.13,13.82 U$4.3 | v47.95,16.76 47.95,18.29 45.82,20.42 v44.81,20.42
GPOINSIDE4  (via drill 0.41)
  Top 0.203: 50.14,19.46 50.19,19.41 v50.19,18.39 | 50.14,19.46 49.89,19.71 49.89,23.16 47.75,25.3 47.24,25.3 IC1.15 | v46.84,14.02 45.72,15.14 42.67,15.14 41.45,16.36 U$4.4 | v84.23,18.59 79.76,18.59 75.18,23.16 v75.18,23.37 | v61.16,23.37 v67.97,23.37 | v57,23.27 55.88,23.27 52.12,19.51 50.19,19.51 50.14,19.46
  Bottom 0.203: U$3.6 23.98,16.36 24.49,16.36 26.82,14.02 30.68,14.02 LED12.K 30.79,14.02 31.9,14.02 33.02,15.14 40.13,15.14 41.35,16.36 U$4.4 | v50.19,18.39 50.19,15.24 48.97,14.02 v46.84,14.02 | v84.23,18.59 86.36,16.46 U$6.8 | v67.97,23.37 v75.18,23.37 | v61.16,23.37 57.1,23.37 v57,23.27
GPOINSIDE5  (via drill 0.41)
  Top 0.203: v49.48,19.1 49.48,22.25 47.75,23.98 47.24,23.98 IC1.14 | v48.67,14.73 48.67,13.82 47.24,12.39 45.72,12.39 | 45.72,12.39 44.09,12.39 42.67,13.82 U$4.5 | 45.72,12.39 45.72,6.71 46.94,5.49 48.56,5.49 50.7,7.62 50.7,7.92 LED13.K | v34.14,17.17 34.14,14.94 v35.36,13.72 | v58.93,11.89 60.05,13.01 60.05,13.82 U$5.3
  Bottom 0.203: v49.48,19.1 49.48,15.54 v48.67,14.73 | v34.14,17.17 27.64,17.17 27.13,17.68 23.37,17.68 22.66,16.97 22.66,15.85 24.59,13.92 25.09,13.92 U$3.7 | v35.36,13.72 40.23,8.84 46.23,8.84 46.94,9.55 48.97,9.55 49.53,8.99 | 49.53,8.99 50.49,8.03 50.7,8.03 LED13.K | v58.93,11.89 57.1,11.89 55.98,10.77 55.98,10.46 54.56,9.04 49.58,9.04 49.53,8.99
GPOINSIDE6  (via drill 0.41)
  Top 0.203: LED14.K 50.8,14.02 51.92,14.02 53.03,15.14 60.05,15.14 61.27,16.36 U$5.4 | v43.99,20.93 45.82,22.76 47.14,22.76 IC1.13 | v42.57,10.77 42.57,11.79 v43.08,12.29
  Bottom 0.203: 43.99,17.68 43.99,16.46 U$4.6 43.89,16.36 43.89,13.31 43.08,12.5 v43.08,12.29 | 43.99,17.68 v43.99,20.93 | 43.99,17.68 38.3,17.68 37.08,16.46 26.52,16.46 U$3.8 | v42.57,10.77 46.33,10.77 49.48,13.92 50.7,13.92 LED14.K
GPOINSIDE7  (via drill 0.41)
  Top 0.203: v48.77,20.42 47.75,21.44 47.24,21.44 IC1.12 | U$6.3 80.06,13.82 79.86,13.82 75.29,9.25 72.03,9.25 70.81,8.03 LED15.K
  Bottom 0.203: 48.77,19.81 48.77,16.56 46.94,14.73 46.02,14.73 45.21,13.92 U$4.7 | 48.77,19.81 v48.77,20.42 | 63.86,12.65 62.69,13.82 U$5.5 | 63.86,12.65 65.13,11.38 66.65,11.38 70,8.03 70.71,8.03 LED15.K | 48.77,19.81 50.19,19.81 56.29,13.72 56.29,12.8 56.49,12.6 63.8,12.6 63.86,12.65
GPOINSIDE8  (via drill 0.41)
  Top 0.203: v45.52,19.71 46.02,20.22 47.14,20.22 IC1.11 | v57.4,11.18 55.58,9.35 49.17,9.35 48.06,10.46 48.06,11.99 49.38,13.31 49.38,16.36 48.26,17.48 47.55,17.48 46.53,16.46 U$4.8 | v59.94,11.89 61.37,13.31 61.37,14.43 63.3,16.36 63.8,16.36 U$5.6
  Bottom 0.203: v45.52,19.71 45.52,17.37 46.43,16.46 U$4.8 | U$5.6 63.91,16.36 64.62,16.36 66.95,14.02 70.71,14.02 LED16.K 70.81,14.02 71.93,15.14 79.35,15.14 80.57,16.36 81.28,16.36 U$6.4 | v57.4,11.18 59.23,11.18 v59.94,11.89
I2C_SCL  (via drill 0.41)
  Top 0.203: v97.43,25.6 100.48,25.6 100.79,25.91 100.79,26.72 IC2.12
  Bottom 0.203: v97.43,25.6 97.16,25.4 90.17,25.4 89.53,24.77 87.63,24.77 86.68,25.72 SERIAL.4
I2C_SDA  (via drill 0.41)
  Top 0.203: v95.2,27.84 99.87,27.84 100.08,27.64 100.08,26.82 IC2.13
  Bottom 0.203: SERIAL.3 86.68,28.26 87.31,28.26 88.27,27.3 94.61,27.3 94.93,27.62 v95.2,27.84
N$1
  Top 0.406: SJ1.1 78.42,26.04 80.01,26.04 80.96,26.99 82.87,26.99 83.82,26.04 SERIAL.6
N$2
  Top 0.203: R3.1 73.05,17.07 73.05,14.22 73.25,14.02 LED16.A
N$3
  Top 0.203: R4.1 73.05,4.88 73.05,7.72 73.25,7.92 LED15.A
N$4  (via drill 0.41)
  Top 0.203: v51.92,17.07 52.93,17.07 R5.1
  Bottom 0.203: v51.92,17.07 51.92,15.34 53.24,14.02 LED14.A
N$7
  Top 0.203: R6.1 52.93,4.78 50.39,4.78 48.77,3.15 41.66,3.15 41.15,3.66 41.15,4.27 41.96,5.08 49.07,5.08 51,7.01 52.32,7.01 53.24,7.92 LED13.A
N$8
  Top 0.203: R7.1 33.02,17.07 33.02,14.22 33.22,14.02 LED12.A
N$9
  Top 0.203: R8.1 33.02,4.88 33.02,7.72 33.22,7.92 LED11.A
N$11
  Top 0.203: R9.1 13.01,17.07 13.01,14.22 13.21,14.02 LED10.A
N$12
  Top 0.203: R10.1 13.01,4.88 13.01,7.72 13.21,7.92 LED9.A

### Text on the board
_tsilk: PCB-TLY-BRD4, v03-16 / SKAARHOJ 2016 | O | 1-2-3 | 2-3-4 | 3-4-1 | 4-1-2
_bsilk: PRV LED | PRG LED